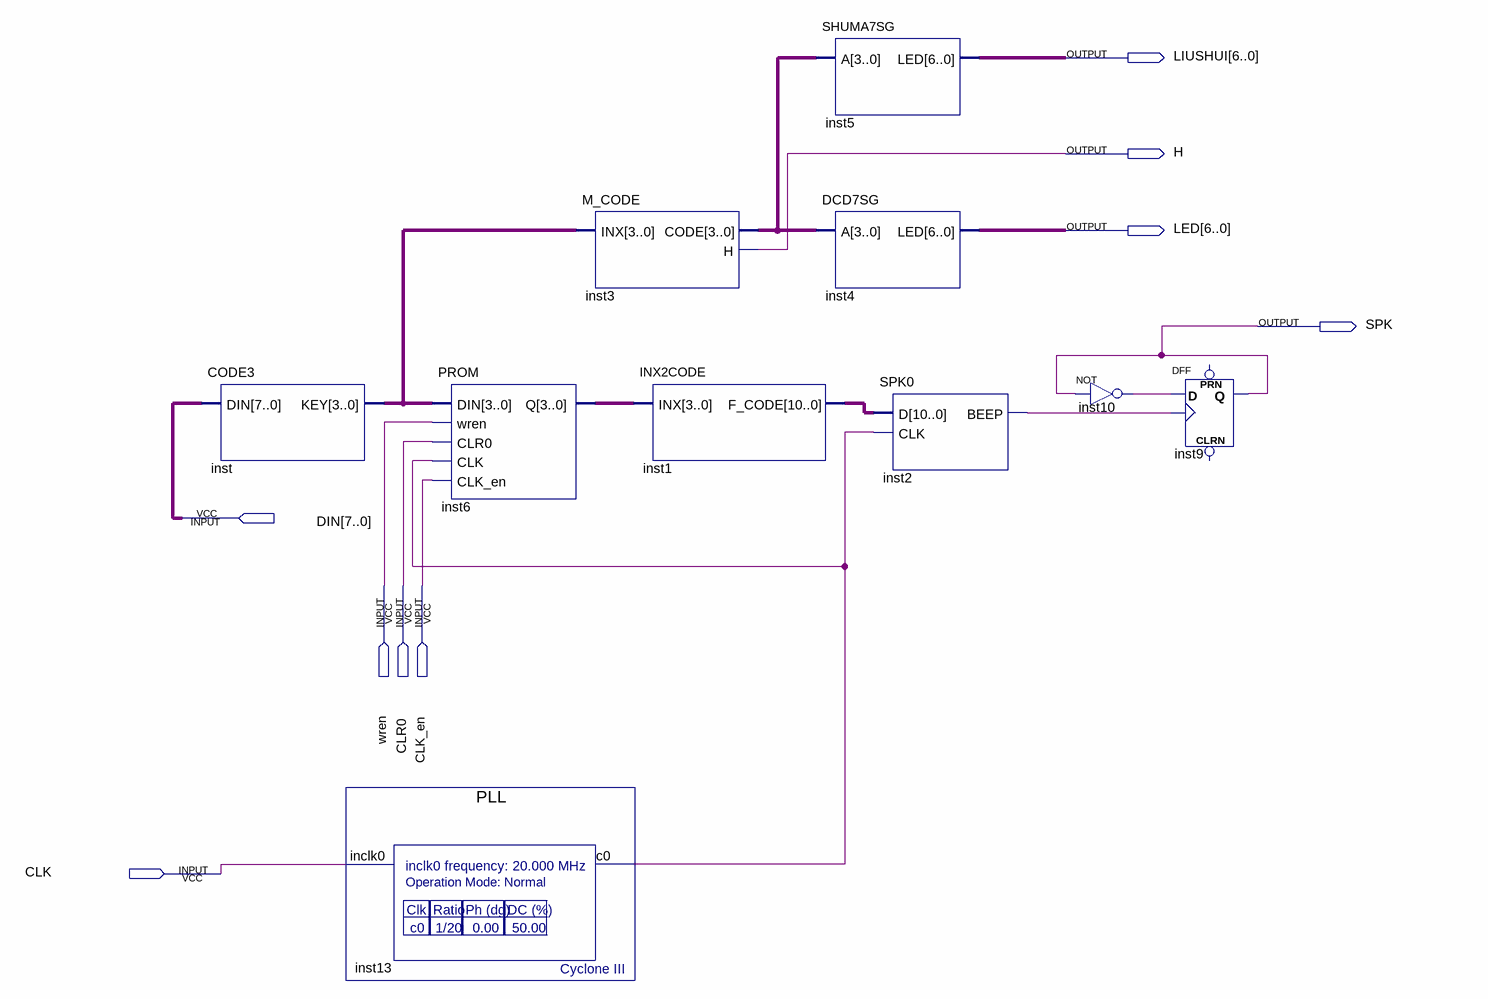
[diagram p0: schematic sheet]
// Quartus schematic music.bdf as structural Verilog: 10 symbols, 9 pins
module music (
  input  [7:0] DIN,
  input  wren,
  input  CLR0,
  input  CLK_en,
  input  CLK,
  output [6:0] LIUSHUI,
  output H,
  output [6:0] LED,
  output SPK
);

  wire inst2_beep, inst10_out, inst13_c0;
  wire [3:0] inst3_code, inst6_q, inst_key;
  wire [10:0] inst1_f_code;

  CODE3 inst (.DIN(DIN), .KEY(inst_key));
  PLL inst13 (.inclk0(CLK), .c0(inst13_c0));
  PROM inst6 (.DIN(inst_key), .wren(wren), .CLR0(CLR0), .CLK(inst13_c0), .CLK_en(CLK_en), .Q(inst6_q));
  M_CODE inst3 (.INX(inst_key), .CODE(inst3_code), .H(H));
  INX2CODE inst1 (.INX(inst6_q), .F_CODE(inst1_f_code));
  SHUMA7SG inst5 (.A(inst3_code), .LED(LIUSHUI));
  DCD7SG inst4 (.A(inst3_code), .LED(LED));
  SPK0 inst2 (.D(inst1_f_code), .CLK(inst13_c0), .BEEP(inst2_beep));
  not inst10 (inst10_out, SPK);
  DFF inst9 (.CLK(inst2_beep), .D(inst10_out), .Q(SPK));  // open: CLRN, PRN
endmodule
